# EAGLE schematic ESP32V1 based led+button (EAGLE 9.6.2)
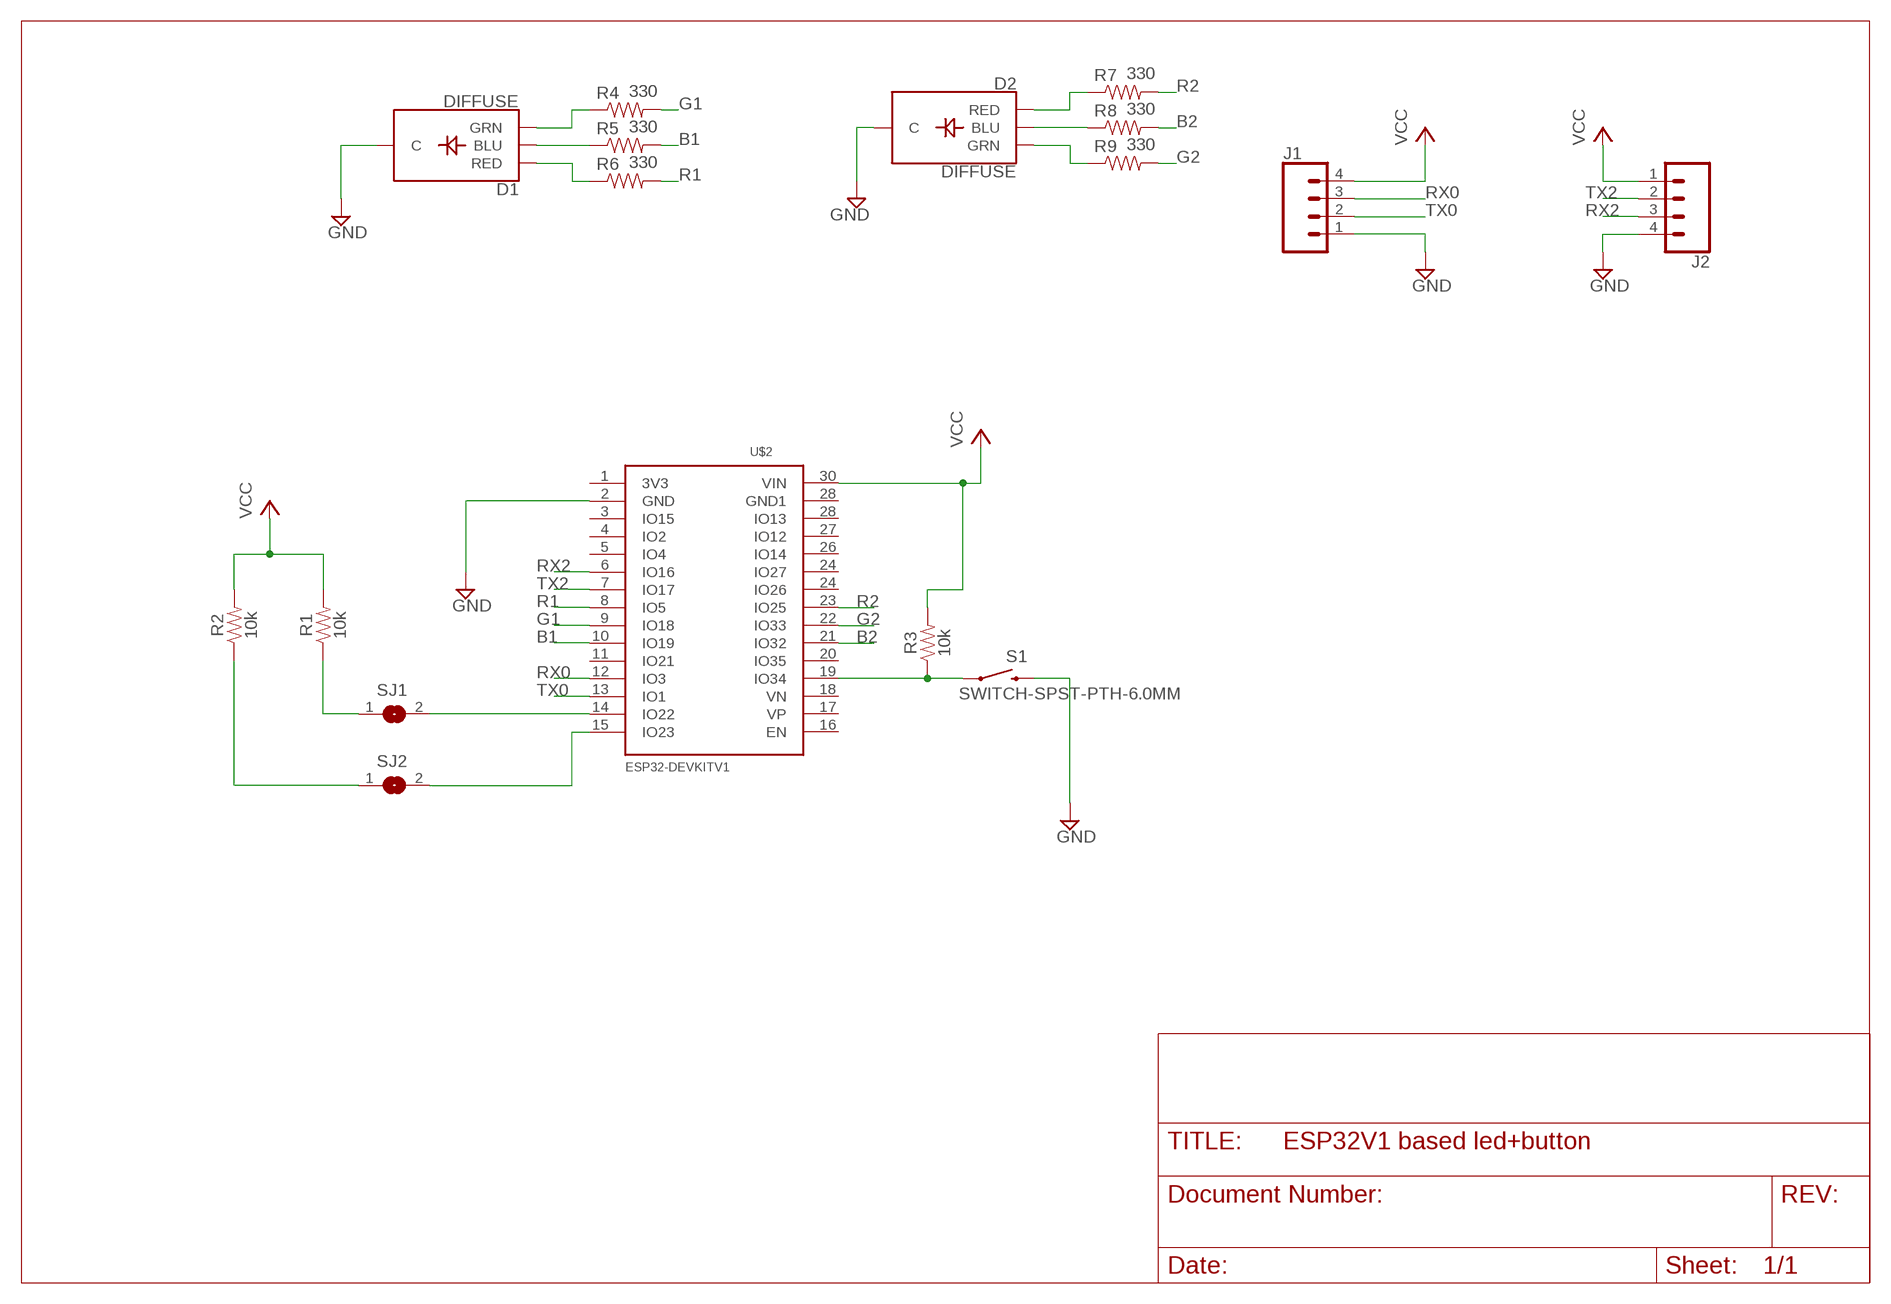
[diagram p0: schematic, sheet 1]

## Parts
D1  DIFFUSE  LED-RGB-CCDIFFUSE  [LED-RGB-THRU]
D2  DIFFUSE  LED-RGB-CCDIFFUSE  [LED-RGB-THRU]
J1  CONN_04  [1X04]
J2  CONN_04  [1X04]
R1  10k  10KOHM-HORIZ-1/4W-1%  [AXIAL-0.3]
R2  10k  10KOHM-HORIZ-1/4W-1%  [AXIAL-0.3]
R3  10k  10KOHM-HORIZ-1/4W-1%  [AXIAL-0.3]
R4  330  330OHM-HORIZ-1/10W-5%  [AXIAL-0.3]
R5  330  330OHM-HORIZ-1/10W-5%  [AXIAL-0.3]
R6  330  330OHM-HORIZ-1/10W-5%  [AXIAL-0.3]
R7  330  330OHM-HORIZ-1/10W-5%  [AXIAL-0.3]
R8  330  330OHM-HORIZ-1/10W-5%  [AXIAL-0.3]
R9  330  330OHM-HORIZ-1/10W-5%  [AXIAL-0.3]
S1  SWITCH-SPST-PTH-6.0MM  MOMENTARY-SWITCH-SPST-PTH-6.0MM-KIT  [TACTILE_SWITCH_PTH_6.0MM_KIT]
SJ1  SJW  [SJW]
SJ2  SJW  [SJW]
U$2  ESP32DEVKITV1  [ESP32-DEVKITV1]

## Nets
B1: R5.P$2 U$2.10(IO19)
B2: R8.P$2 U$2.21(IO32)
G1: R4.P$2 U$2.9(IO18)
G2: R9.P$2 U$2.22(IO33)
GND: D1.2(C) D2.2(C) J1.1 J2.4 S1.3 U$2.2(GND)
N$1: SJ2.2 U$2.15(IO23)
N$2: R2.P$1 SJ2.1
N$3: SJ1.2 U$2.14(IO22)
N$4: R1.P$1 SJ1.1
N$5: D1.3(GRN) R4.P$1
N$6: D1.4(BLU) R5.P$1
N$7: D1.1(RED) R6.P$1
N$8: D2.4(BLU) R8.P$1
N$9: R3.P$1 S1.1 U$2.19(IO34)
N$10: D2.1(RED) R7.P$1
N$17: D2.3(GRN) R9.P$1
R1: R6.P$2 U$2.8(IO5)
R2: R7.P$2 U$2.23(IO25)
RX0: J1.3 U$2.12(IO3)
RX2: J2.3 U$2.6(IO16)
TX0: J1.2 U$2.13(IO1)
TX2: J2.2 U$2.7(IO17)
VCC: J1.4 J2.1 R1.P$2 R2.P$2 R3.P$2 U$2.30(VIN)
Unconnected: U$2.1(3V3) U$2.3(IO15) U$2.4(IO2) U$2.5(IO4) U$2.11(IO21) U$2.16(EN) U$2.17(VP) U$2.18(VN) U$2.20(IO35) U$2.24(IO26) U$2.24(IO27) U$2.26(IO14) U$2.27(IO12) U$2.28(GND1) U$2.28(IO13)

## Library data of the parts
D1 D2 = SparkFun-LED:LED-RGB-CC: LED-RGB Common Cathode Packages: LED RGB-THRU LED_PIRANHA_5MM SparkFun Products: RGB Diffused Common Cathode- Diffuse <[https://www.sparkfun.com/products/9264]> RGB Diffused Common Cathode - Clear <[https://www.sparkfun.com/products/105]> LED-RGB 5mm Square (Piranha) <[https://www.sparkfun.com/products/11679]>; PROD_ID: DIO-09434
J1 J2 = SparkFun-Connectors:CONN_04: Multi connection point. Often used as Generic Header-pin footprint for 0.1 inch spaced/style header connections On any of the 0.1 inch spaced packages, you can populate with these: Break Away Headers - Straight <https://www.sparkfun.com/products/116> (PRT-00116) Break Away Male Headers - Right Angle <https://www.sparkfun.com/products/553> (PRT-00553) Female Headers <https://www.sparkfun.com/products/115> (PRT-00115) Break Away Headers - Machine Pin <https://www.sparkfun.com/products/117> (PRT-00117) Break Away Female Headers - Swiss Machine Pin <https://www.sparkfun.com/products/743> (PRT-00743) For SCREWTERMINALS and SPRING TERMINALS visit here: Screw Terimnals on SparkFun.com <https://www.sparkfun.com/search/results?term=Screw+Terminals> (5mm/3.5mm/2.54mm spacing) This device is also useful as a general connection point to wire up your design to another part of your project. Our various solder wires solder well into these plated through hole pads. Hook-Up Wire - Assortment (Stranded, 22 AWG) <https://www.sparkfun.com/products/11375> (PRT-11375) Hook-Up Wire - Assortment (Solid Core, 22 AWG) <https://www.sparkfun.com/products/11367> (PRT-11367) View the entire wire category on our website here <https://www.sparkfun.com/categories/141> Special notes: Molex polarized connector foot print use with SKU : PRT-08231 with associated crimp pins and housings. 1MM SMD Version SKU: PRT-10208; PROD_ID: CONN-09696
R1-R3 = SparkFun-Resistors:10KOHM: 10kΩ resistor A resistor is a passive two-terminal electrical component that implements electrical resistance as a circuit element. Resistors act to reduce current flow, and, at the same time, act to lower voltage levels within circuits. - Wikipedia; PROD_ID: RES-12183
R4-R9 = SparkFun-Resistors:330OHM: 330Ω resistor A resistor is a passive two-terminal electrical component that implements electrical resistance as a circuit element. Resistors act to reduce current flow, and, at the same time, act to lower voltage levels within circuits. - Wikipedia; PROD_ID: RES-8371
S1 = SparkFun-Switches:MOMENTARY-SWITCH-SPST: Momentary Switch (Pushbutton) - SPST Normally-open (NO) SPST momentary switches (buttons, pushbuttons). Variants PTH-12MM - 12mm square, through-hole Momentary Pushbutton Switch - 12mm Square <https://www.sparkfun.com/products/9190> (COM-09190) PTH-6.0MM, PTH-6.0MM-KIT - 6.0mm square, through-hole Mini Pushbutton Switch <https://www.sparkfun.com/products/97> (COM-00097) KIT package intended for soldering kit's - only one side of pads' copper is exposed. PTH-RIGHT-ANGLE-KIT - Right-angle, through-hole Right Angle Tactile Button <https://www.sparkfun.com/products/10791> - Used on SparkFun BigTime Watch Kit <https://www.sparkfun.com/products/11734> SMD-12MM - 12mm square, surface-mount Tactile Button - SMD (12mm) <https://www.sparkfun.com/products/12993> (COM-12993) Used on SparkFun PicoBoard <https://www.sparkfun.com/products/11888> SMD-4.5MM - 4.5mm Square Trackball Switch Used on SparkFun Blackberry Trackballer Breakout <https://www.sparkfun.com/products/13169> SMD-4.6MMX2.8MM - 4.60mm x 2.80mm, surface mount Used on SparkFun SAMD21 Mini Breakout <https://www.sparkfun.com/products/13664> SMD-5.2MM, SMD-5.2-REDUNDANT - 5.2mm square, surface-mount Mini Pushbutton Switch - SMD <https://www.sparkfun.com/products/8720> (COM-08720) Used on Arduino Pro Mini <https://www.sparkfun.com/products/11114> REDUNDANT package connects both switch circuits together SMD-6.0X3.5MM - 6.0 x 3.5mm, surface mount Momentary Reset Switch SMD <https://www.sparkfun.com/products/8229> (COM-08229) SMD-6.2MM-TALL - 6.2mm square, surface mount Tactile Button - SMD (6mm) <https://www.sparkfun.com/products/12992> Used on SparkFun Digital Sandbox <https://www.sparkfun.com/products/12651> SMD-RIGHT-ANGLE - Right-angle, surface mount Used on SparkFun Block for Intel® Edison - Arduino <https://www.sparkfun.com/products/13036>; PROD_ID: SWCH-08441; SF_SKU: COM-00097
SJ1 SJ2 = jumper:SJ: SMD solder JUMPER
U$2 = ESP32-0DEVKITV1:ESP32DEVKITV1